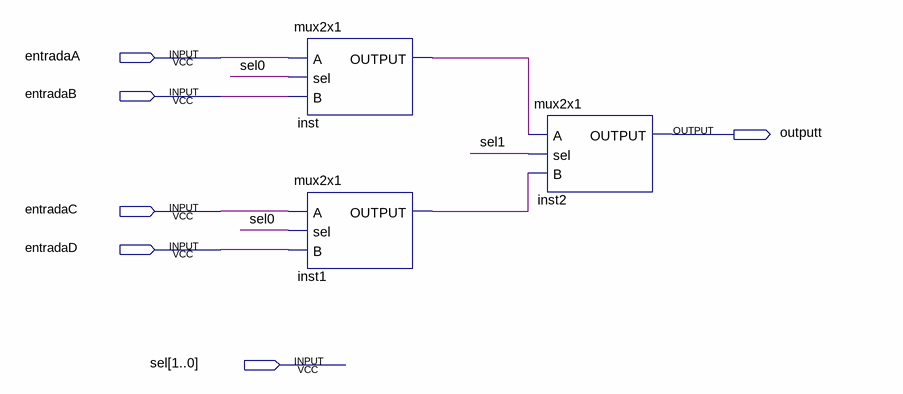
[diagram p0: schematic sheet]
// Quartus schematic mux4x11bit.bdf as structural Verilog: 3 symbols, 6 pins
module mux4x11bit (
  input  entradaA,
  input  entradaB,
  input  entradaC,
  input  entradaD,
  input  [1:0] sel,
  output outputt
);

  wire inst1_output, inst_output;

  mux2x1 inst (.A(entradaA), .sel(sel[0]), .B(entradaB), .OUTPUT(inst_output));
  mux2x1 inst1 (.A(entradaC), .sel(sel[0]), .B(entradaD), .OUTPUT(inst1_output));
  mux2x1 inst2 (.A(inst_output), .sel(sel[1]), .B(inst1_output), .OUTPUT(outputt));
endmodule
